# Altium schematic sheet LAN_RJ45.SchDoc: TBD
size A; Date: 1/18/2023; ApprovedBy: KEW; CheckedBy: KEW; Author: KEW; CompanyName: Gamber-Johnson LLC; Engineer: KEW; Organization: Gamber-Johnson LLC; Address1: 5001 Joerns Dr.; Address2: Stevens Point; Address3: WI 54481; DocumentNumber: TBD; DrawnBy: KEW; RevisionEngineer: KEW; ProjectTitle: USB-OTG Puck; Revision: X2; SheetNumber: 3; SheetTotal: 5; RevisionDescription: Initial; DrawnByDate: 1/18/2023; ProjectNumber: 7150-0297; AssemblyNumber: 7150-XXXX; RevisionDate: 1/18/2023; SheetTitle: LAN_RJ45; Time: 7:43 AM; Application_BuildNumber: TBD
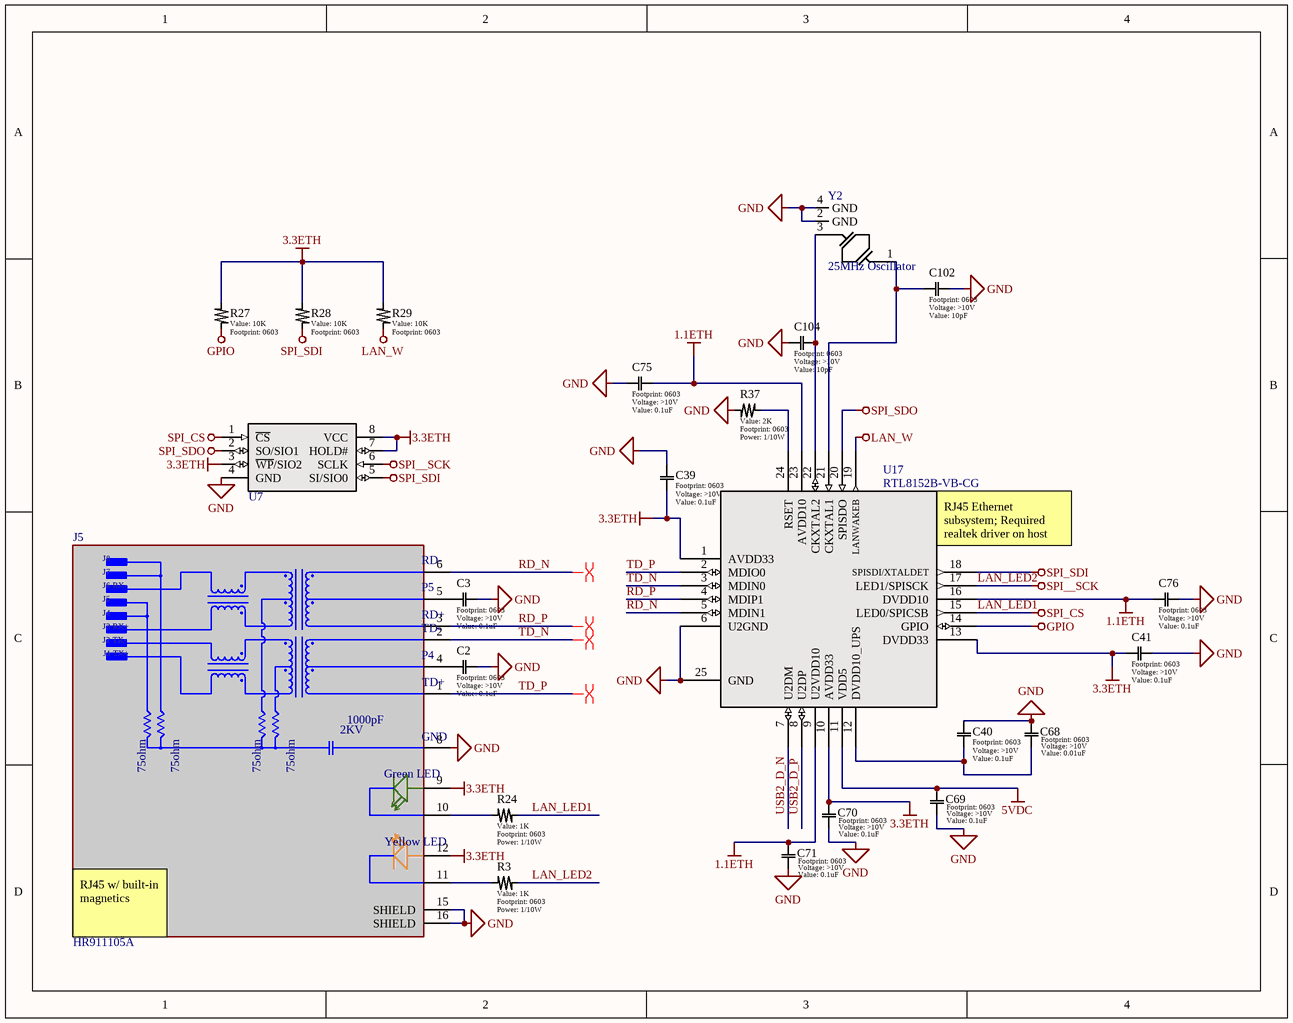
[diagram p0: LAN_RJ45.SchDoc]

## Parts
C2  value 0.1uF  Voltage: >10V  [0603]  (hidden comment: Generic Capacitor)
C3  value 0.1uF  Voltage: >10V  [0603]  (hidden comment: Generic Capacitor)
C39  value 0.1uF  Voltage: >10V  [0603]  (hidden comment: Generic Capacitor)
C40  value 0.1uF  Voltage: >10V  [0603]  (hidden comment: Generic Capacitor)
C41  value 0.1uF  Voltage: >10V  [0603]  (hidden comment: Generic Capacitor)
C68  value 0.01uF  Voltage: >10V  [0603]  (hidden comment: Generic Capacitor)
C69  value 0.1uF  Voltage: >10V  [0603]  (hidden comment: Generic Capacitor)
C70  value 0.1uF  Voltage: >10V  [0603]  (hidden comment: Generic Capacitor)
C71  value 0.1uF  Voltage: >10V  [0603]  (hidden comment: Generic Capacitor)
C75  value 0.1uF  Voltage: >10V  [0603]  (hidden comment: Generic Capacitor)
C76  value 0.1uF  Voltage: >10V  [0603]  (hidden comment: Generic Capacitor)
C102  value 10pF  Voltage: >10V  [0603]  (hidden comment: Generic Capacitor)
C104  value 10pF  Voltage: >10V  [0603]  (hidden comment: Generic Capacitor)
J5  HR911105A  [HR911105A]
R3  value 1K  Power: 1/10W  [0603]  (hidden comment: Generic Resistor)
R24  value 1K  Power: 1/10W  [0603]  (hidden comment: Generic Resistor)
R27  value 10K  [0603]  (hidden comment: Generic Resistor)
R28  value 10K  [0603]  (hidden comment: Generic Resistor)
R29  value 10K  [0603]  (hidden comment: Generic Resistor)
R37  value 2K  Power: 1/10W  [0603]  (hidden comment: Generic Resistor)
U7  FlashMem  [8-SOIC (0.209", 5.30mm WIDTH)]  (value not drawn)
U17  RTL8152B-VB-CG  [RTL8152B-VB-CG]
Y2  25MHz Oscillator  [ABM8G-25.000MHZ-B4Y-T]

## Nets
1.1ETH: C71.1 C75.1 C76.2 U17.9(U2VDD10) U17.16(DVDD10) U17.23(AVDD10)
3.3ETH: C39.1 C41.2 C70.1 J5.9(GA) J5.12(YA) R27.1 R28.1 R29.1 U7.3(~{WP}/SIO2) U7.7(HOLD#) U7.8(VCC) U17.1(AVDD33) U17.10(AVDD33) U17.13(DVDD33)
5VDC: C69.1 U17.11(VDD5)
GND: C2.1 C3.1 C39.2 C40.1 C41.1 C68.1 C69.2 C70.2 C71.2 C75.2 C76.1 C102.1 C104.2 J5.8(GND) J5.15(SHIELD) J5.16(SHIELD) R37.1 U7.4(GND) U17.6(U2GND) U17.25(GND) Y2.2(GND) Y2.4(GND)
GPIO: R27.2 U17.14(GPIO)
LAN_LED1: R24.2 U7.1(~{CS}) U17.15(LED0/SPICSB)  [also labelled SPI_CS]
LAN_LED2: R3.2 U7.6(SCLK) U17.17(LED1/SPISCK)  [also labelled SPI__SCK]
LAN_W: R29.2 U17.19(LANWAKEB)
SPI_SDI: R28.2 U7.5(SI/SIO0) U17.18(SPISDI/XTALDET)
SPI_SDO: U7.2(SO/SIO1) U17.20(SPISDO)
RD_N: J5.6(RD-) U17.5(MDIN1)
RD_P: J5.3(RD+) U17.4(MDIP1)
TD_N: J5.2(TD-) U17.3(MDIN0)
TD_P: J5.1(TD+) U17.2(MDIO0)
USB2_D_N: U17.7(U2DM)
USB2_D_P: U17.8(U2DP)
NetC2_2: C2.2 J5.4(P4)
NetC3_2: C3.2 J5.5(P5)
NetC40_2: C40.2 C68.2 U17.12(DVDD10_UPS)
NetC102_2: C102.2 U17.21(CKXTAL1) Y2.1
NetC104_1: C104.1 U17.22(CKXTAL2) Y2.3
NetJ5_10: J5.10(GC) R24.1
NetJ5_11: J5.11(YC) R3.1
NetR37_2: R37.2 U17.24(RSET)

## Layout directives
differential pair: RD_N, RD_P, TD_N, TD_P

## Notes on the sheet
- (near U17) RJ45 Ethernet subsystem; Required realtek driver on host
- RJ45 w/ built-in magnetics
- REV
- REVISIONS
- DATE
- DESCRIPTION
- BY
- UNLESS OTHERWISE SPECIFIED, DRAWING DEFINITIONS AND TOLERANCES SHALL BE FOUND UNDER SUPPLIER STANDARDS SS-001. THIS PART AND ALL COMPONENTS OF IT MUST BE RoHS & REACH COMPLIANT. A CERTIFICATE OF COMPLIANCE MUST BE PROVIDED UPON REQUEST.
- ALL INFORMATION ON THIS DOCUMENT IS THE SOLE PROPERTY OF GAMBER-JOHNSON AND SHALL NOT BE COPIED, REPRODUCED, USED OR DISCLOSED IN WHOLE OR IN PART WITHOUT THE WRITTEN CONSENT OF GAMBER-JOHNSON
- TOLERANCES
  .00 ± .060
  .000 ± .020
  .0000 ± .005
  ANGELS ± 1°
- DRAWN BY:
- PROJECT NUMBER:
- SHEET TITLE:
- SHEET
- OF
- DATE:
- LOCATION:
- ASSEMBLY NUMBER
- SIZE
- GAMBER-JOHNSON LLC
  3001 BORHAM AVE.
  STEVENS POINT, WI 54481
  +1 (715) 344-5209
- B
- (in symbol HR911105A) J8; J7; J6 RX-; J4; J3 RX+; J2 TX-; J1 TX+; 1000pF; 75ohm; 2KV; Green LED; Yellow LED

## Library data of the parts
C2 C3 C39-C41 C68-C71 C75 C76 C102 C104 = Generic Capacitor: Tolerance: 10%
J5 = HR911105A: RJ45 Receptacle 1 WithLED Plugin Ethernet; LCSC PN: C12074
R3 R24 R37 = Generic Resistor: Tolerance: 1%
R27-R29 = Generic Resistor: Tolerance: 1%; Power: 1/10W
U7 = MX25L1606EM2I-12G: 16Mbit SPI SOIC-8-208mil NOR FLASH; Supplier 1: Digi-Key; Supplier Part Number 1: 1092-1135-ND; LCSC PN: C18192
U17 = RTL8152B-VB-CG: Ethernet Controllers 1V ~ 5.25V IEEE 802.3, USB 2.0, USB 1.1 MII, SPI, USB QFN-24_4x4x05P Ethernet ICs ROHS; LCSC PN: C50656
Y2 = ABM8G-25.000MHZ-B4Y-T: 25 MHz ±30ppm Crystal 10pF 60 Ohms 4-SMD, No Lead / SMD3225-4P; Manufacturer: Abracon; ESR (Equivalent Series Resistance): 60R; Supplier 1: Digi-Key; Supplier Part Number 1: 535-10297-1-ND; Manufacturer Part Number: ABM8G-25.000MHZ-B4Y-T; RoHS: Yes; Category: Crystals; Stock 1: 123; Pricing 1: 1=0.82000, 10=0.72900, 50=0.68120, 100=0.60190, 500=0.57024 (USD); Mount: Surface Mount; Case/Package: SMD/SMT; Number of Pins: 4; Min Operating Temperature: -20°C; Max Operating Temperature: 70°C; Packaging: Tape and Reel; Frequency Tolerance: 30ppm; Load Capacitance: 10pF; Frequency: 25MHz; Package Quantity: 1000; Tolerance: 30ppm; Frequency Stability: 30ppm; Termination: SMD/SMT; Series: ABM8G; Series Resistance: 60R; Operating Frequency: 25 MHz; Length: 3.2mm; Width: 0.098inch; Height: 0.039inch; Depth: 2.5mm; REACH SVHC: Unknown; Lead Free: Lead Free; ComponentLink1URL: https://datasheet.ciiva.com/855/abm8g-855228.pdf?src-supplier=Digi-Key; ComponentLink1Description: https://datasheet.ciiva.com/855/abm8g-855228.pdf?src-supplier=Digi-Key; ComponentLink2URL: https://datasheet.ciiva.com/855/abm8g-855229.pdf?src-supplier=Digi-Key; ComponentLink2Description: https://datasheet.ciiva.com/855/abm8g-855229.pdf?src-supplier=Digi-Key; ComponentLink3URL: https://datasheet.ciiva.com/855/abm8g-855230.pdf?src-supplier=Digi-Key; ComponentLink3Description: https://datasheet.ciiva.com/855/abm8g-855230.pdf?src-supplier=Digi-Key; ComponentLink4URL: https://datasheet.ciiva.com/4945/abm8g-10572-4945134.pdf?src-supplier=Mouser; ComponentLink4Description: https://datasheet.ciiva.com/4945/abm8g-10572-4945134.pdf?src-supplier=Mouser; ComponentLink5URL: https://datasheet.ciiva.com/7998/abm8g-7998635.pdf?src-supplier=Element14; ComponentLink5Description: https://datasheet.ciiva.com/7998/abm8g-7998635.pdf?src-supplier=Element14; ComponentLink6URL: https://datasheet.ciiva.com/28508/1883677-28508586.pdf?src-supplier=Element14; ComponentLink6Description: https://datasheet.ciiva.com/28508/1883677-28508586.pdf?src-supplier=Element14; ComponentLink7URL: https://datasheet.ciiva.com/16416/abm8g-16416874.pdf?src-supplier=Future+Electronics; ComponentLink7Description: https://datasheet.ciiva.com/16416/abm8g-16416874.pdf?src-supplier=Future+Electronics; LCSC PN: C9006